# Altium schematic sheet Link.SchDoc
size A4; SheetNumber: 4; SheetTotal: 4
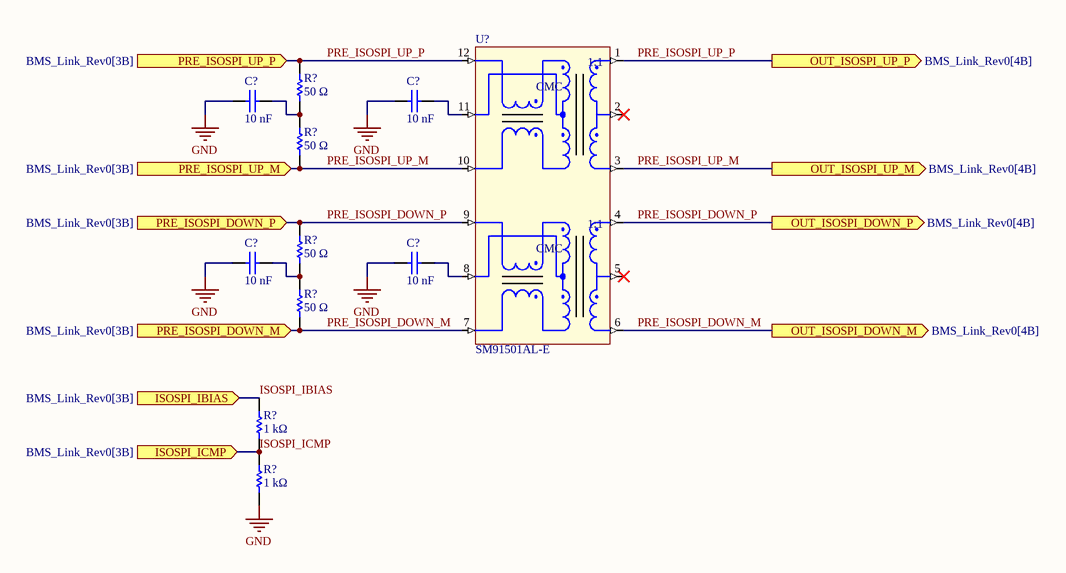
[diagram p0: Link.SchDoc]

## Parts
(Parts that share a designator on the sheet are numbered #1, #2 ... from top to bottom, then left to right.)
C?#1  value 10 nF  [0805_CAPACITOR]  (hidden comment: CL21B103KBANNNC)
C?#2  value 10 nF  [0805_CAPACITOR]  (hidden comment: CL21B103KBANNNC)
C?#3  value 10 nF  [0805_CAPACITOR]  (hidden comment: CL21B103KBANNNC)
C?#4  value 10 nF  [0805_CAPACITOR]  (hidden comment: CL21B103KBANNNC)
R?#1  value 50 Ω  [0805_RESISTOR]  (hidden comment: RT0805BRB0750RL)
R?#2  value 50 Ω  [0805_RESISTOR]  (hidden comment: RT0805BRB0750RL)
R?#3  value 50 Ω  [0805_RESISTOR]  (hidden comment: RT0805BRB0750RL)
R?#4  value 50 Ω  [0805_RESISTOR]  (hidden comment: RT0805BRB0750RL)
R?#5  value 1 kΩ  [0805_RESISTOR]  (hidden comment: ERA-6AEB102V)
R?#6  value 1 kΩ  [0805_RESISTOR]  (hidden comment: ERA-6AEB102V)
U?  SM91501AL-E  [SOP200P1473X500-12N]

## Ports
ISOSPI_IBIAS (in, see BMS_Link_Rev0[3B]), ISOSPI_ICMP (in, see BMS_Link_Rev0[3B]), OUT_ISOSPI_DOWN_M (out, see BMS_Link_Rev0[4B]), OUT_ISOSPI_DOWN_P (out, see BMS_Link_Rev0[4B]), OUT_ISOSPI_UP_M (out, see BMS_Link_Rev0[4B]), OUT_ISOSPI_UP_P (out, see BMS_Link_Rev0[4B]), PRE_ISOSPI_DOWN_M (in, see BMS_Link_Rev0[3B]), PRE_ISOSPI_DOWN_P (in, see BMS_Link_Rev0[3B]), PRE_ISOSPI_UP_M (in, see BMS_Link_Rev0[3B]), PRE_ISOSPI_UP_P (in, see BMS_Link_Rev0[3B])

## Nets
GND: C?#1.1 C?#2.1 C?#3.1 C?#4.1 R?#6.2
ISOSPI_IBIAS: R?#5.1 ; port ISOSPI_IBIAS
ISOSPI_ICMP: R?#5.2 R?#6.1 ; port ISOSPI_ICMP
PRE_ISOSPI_DOWN_M: R?#4.2 U?.6 U?.7 ; port PRE_ISOSPI_DOWN_M, port OUT_ISOSPI_DOWN_M
PRE_ISOSPI_DOWN_P: R?#3.1 U?.4 U?.9 ; port PRE_ISOSPI_DOWN_P, port OUT_ISOSPI_DOWN_P
PRE_ISOSPI_UP_M: R?#2.2 U?.3 U?.10 ; port PRE_ISOSPI_UP_M, port OUT_ISOSPI_UP_M
PRE_ISOSPI_UP_P: R?#1.1 U?.1 U?.12 ; port PRE_ISOSPI_UP_P, port OUT_ISOSPI_UP_P
NetC?#1_2: C?#1.2 R?#1.2 R?#2.1
NetC?#2_2: C?#2.2 U?.11
NetC?#3_2: C?#3.2 R?#3.2 R?#4.1
NetC?#4_2: C?#4.2 U?.8

Not connected (* = marked no-connect by the designer): U? 2* 5*

## Notes on the sheet
- (in symbol SM91501AL-E) 1:1; CMC

## Library data of the parts
C?#1-C?#4 = CL21B103KBANNNC: 10 nF ±10% 50V Ceramic Capacitor X7R 0805 (2012 Metric)
R?#1-R?#4 = RT0805BRB0750RL: 50 Ohms ±0.1% 0.125W, 1/8W Chip Resistor 0805 (2012 Metric) Moisture Resistant Thin Film
R?#5 R?#6 = ERA-6AEB102V: 1 kOhms ±0.1% 0.125W, 1/8W Chip Resistor 0805 (2012 Metric) Automotive AEC-Q200 Thin Film
U? = SM91501AL-E: 150µH Pulse Transformer 1CT:1CT Surface Mount